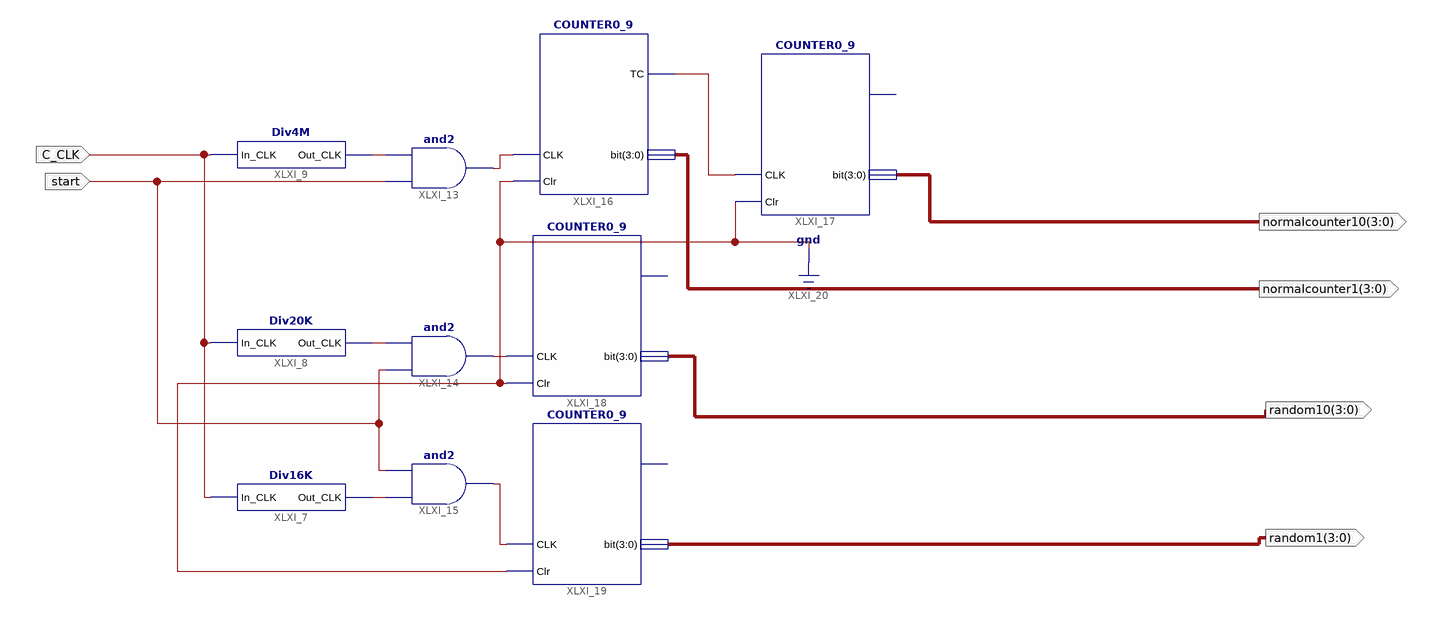
[diagram p0: schematic sheet 1]
// Xilinx ISE schematic counterRandomCir.sch (spartan6) as structural Verilog: 10 symbols, 6 ports
module counterRandomCir (
  input  start,
  input  C_CLK,
  output [3:0] normalcounter10,
  output [3:0] normalcounter1,
  output [3:0] random10,
  output [3:0] random1
);

  wire XLXN_13, XLXN_14, XLXN_15, XLXN_17, XLXN_18, XLXN_21, XLXN_32;

  and XLXI_13 (XLXN_13, start, XLXN_32);
  and XLXI_14 (XLXN_14, start, XLXN_17);
  and XLXI_15 (XLXN_15, XLXN_18, start);
  Div20K XLXI_8 (.In_CLK(C_CLK), .Out_CLK(XLXN_17));
  Div16K XLXI_7 (.In_CLK(C_CLK), .Out_CLK(XLXN_18));
  COUNTER0_9 XLXI_16 (.CLK(XLXN_13), .Clr(1'b0), .\bit (normalcounter1), .TC(XLXN_21));
  COUNTER0_9 XLXI_17 (.CLK(XLXN_21), .Clr(1'b0), .\bit (normalcounter10));  // open: TC
  COUNTER0_9 XLXI_18 (.CLK(XLXN_14), .Clr(1'b0), .\bit (random10));  // open: TC
  COUNTER0_9 XLXI_19 (.CLK(XLXN_15), .Clr(1'b0), .\bit (random1));  // open: TC
  Div4M XLXI_9 (.In_CLK(C_CLK), .Out_CLK(XLXN_32));
endmodule
